# EAGLE design ICS40300-preamp-surfacemount_Rev-D (EAGLE 8.2.1)
COMPANY: ADAFRUIT INDUSTRIES; DRAWN: KTOWN; REV: A
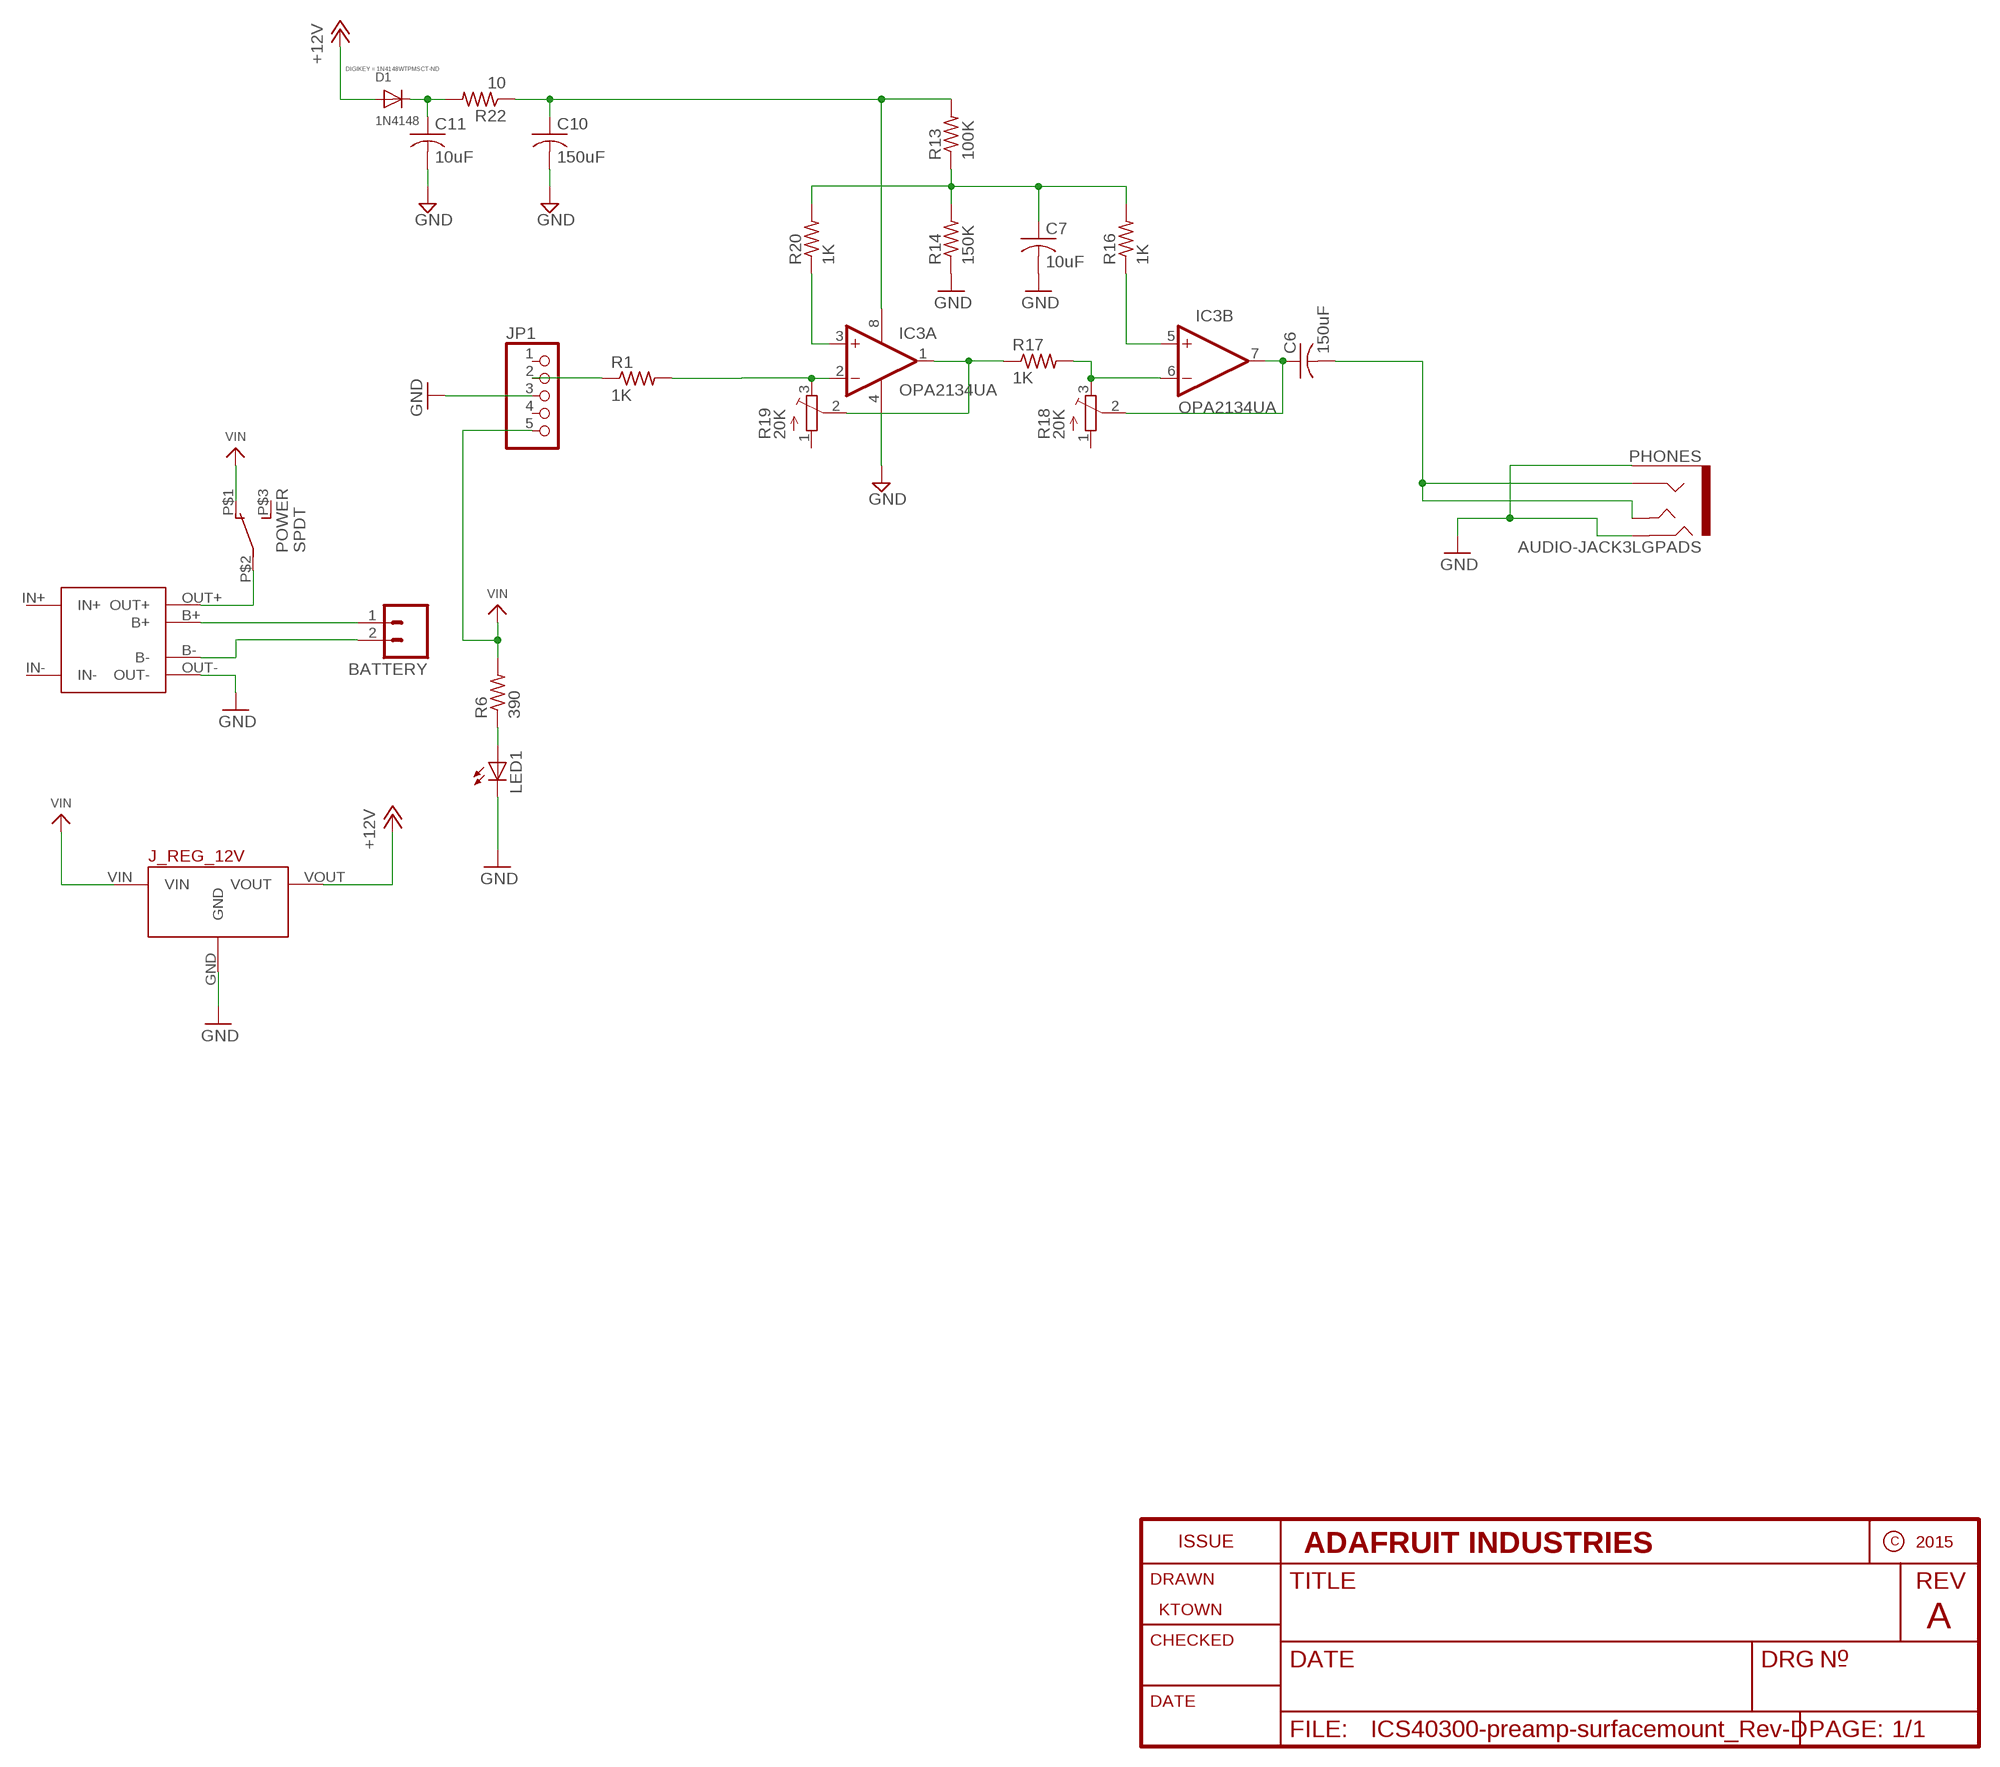
[diagram p0: schematic, sheet 1]

## Parts
BATTERY  M02LOCK  [1X02_LOCK]
C6  150uF  C-USC3216  [C3216]
C7  10uF  C-USC0805K  [C0805K]
C10  150uF  C-USC3216  [C3216]
C11  10uF  C-USC0805K  [C0805K]
D1  1N4148  DIODESOD-123  [SOD-123]
IC3  OPA2134UA  [SO08]
J_REG_12V  POLOLU_VOLTAGE_REGULATORS_3PIN  [POLOLU_5V-12V_STEPUP_U3V12F5-U3V12F12]
JP1  HEADER-1X576MIL  [1X05_ROUND_76]
LED1  LED3MM  [LED3MM]
PHONES  AUDIO-JACK3LGPADS  [AUDIO-JACK-TRRS-SMD]
POWER  SPDT  SWITCH_SPDTCL-SB-12B  [SWITCH_SPDT_CL-SB-12B]
R1  1K  R-US_R0805  [R0805]
R6  390  R-US_R0805  [R0805]
R13  100K  R-US_R0603  [R0603]
R14  150K  R-US_R0603  [R0603]
R16  1K  R-US_R0603  [R0603]
R17  1K  R-US_R0603  [R0603]
R18  20K  TRIMPOTTC33X  [TC33X]
R19  20K  TRIMPOTTC33X  [TC33X]
R20  1K  R-US_R0603  [R0603]
R22  10  R-US_R0603  [R0603]
U$1  TP4056-MODULETP4056  [TP4056-LITHIUM-PROTECTED-MODULE-MOVED-PAD]

## Nets
+12V: D1.A J_REG_12V.VOUT
GND: C7.2 C10.2 C11.2 IC3.4(A:V-) J_REG_12V.GND JP1.3 LED1.K(C) PHONES.EARTH PHONES.RING2 R14.1 U$1.OUT-
N$1: JP1.2 R1.1
N$3: POWER.P$2 U$1.OUT+
N$5: BATTERY.1 U$1.B+
N$6: BATTERY.2 U$1.B-
N$13: IC3.5(B:+IN) R16.1
N$14: C6.1 IC3.7(B:OUT) R18.2(S)
N$15: IC3.6(B:-IN) R17.2 R18.3(E)
N$16: LED1.A R6.1
N$17: C7.1 R13.1 R14.2 R16.2 R20.2
N$18: IC3.3(A:+IN) R20.1
N$19: IC3.1(A:OUT) R17.1 R19.2(S)
N$21: IC3.2(A:-IN) R1.2 R19.3(E)
N$25: C6.2 PHONES.RING1 PHONES.TIP
N$28: C11.1 D1.C R22.2
N$32: C10.1 IC3.8(A:V+) R13.2 R22.1
VIN: J_REG_12V.VIN JP1.5 POWER.P$1 R6.2
Unconnected: JP1.1 JP1.4 POWER.P$3 R18.1(A) R19.1(A)

## Power pins joined to a net without a drawn wire
IN+: U$1.IN+
IN-: U$1.IN-

## Library data of the parts
BATTERY = CMU-ArtFab:M02: Header 2 Standard 2-pin 0.1" header. Use with straight break away headers (SKU : PRT-00116), right angle break away headers (PRT-00553), swiss pins (PRT-00743), machine pins (PRT-00117), and female headers (PRT-00115). Molex polarized connector foot print use with SKU : PRT-08233 with associated crimp pins and housings.
C6 C7 C10 C11 = adafruit:C-US: CAPACITOR, American symbol
D1 = adafruit:DIODE: Diode SMADIODE - SMA Surface Mount Package 20V 1A Schottky Diode Digikey: 641-1014-6-ND DO-1N4148 - Through Hole Small Current Diode SOD-123 20V 1 A (.5mV Vf) Schottky Diode - Digikey: MBRX120TPMSCT-ND SOD-323 10V 570mA (.38mV Vf, 3ns) Schottky Diode - Digikey: ZLLS410CT-ND SOD-523 30V 30mA Schottky Diode (RB751S-40TE61) - Digikey: RB751S-40TE61CT-ND SOT23-R/W - SOT23 Package (R = Solder Paste/Reflow Ovens, W = Hand-Soldering) BAT54Film 40V 300mA - Digikey: 497-7162-1-ND; DIGIKEY: 1N4148WTPMSCT-ND
IC3 = linear:OPA2*: Dual Operational Amplifier Low Power, Single-Supply, Rail-To-Rail Operational Amplifier Source: http://focus.ti.com/lit/ds/symlink/opa2345.pdf http://focus.ti.com .. opa241.pdf http://focus.ti.com/lit/ds/symlink/opa2134.pdf
J_REG_12V = CMU-ArtFab:POLOLU_VOLTAGE_REGULATORS_3PIN: Polulu 5V Step-Up/Step-Down Voltage REgulator S7V7F5
JP1 = microbuilder:HEADER-1X5: PIN HEADER
LED1 = led:LED: LED OSRAM: - CHIPLED LG R971, LG N971, LY N971, LG Q971, LY Q971, LO R971, LY R971 LH N974, LH R974 LS Q976, LO Q976, LY Q976 LO Q996 - Hyper CHIPLED LW Q18S LB Q993, LB Q99A, LB R99A - SideLED LS A670, LO A670, LY A670, LG A670, LP A670 LB A673, LV A673, LT A673, LW A673 LH A674 LY A675 LS A676, LA A676, LO A676, LY A676, LW A676 LS A679, LY A679, LG A679 - Hyper Micro SIDELED® LS Y876, LA Y876, LO Y876, LY Y876 LT Y87S - SmartLED LW L88C, LW L88S LB L89C, LB L89S, LG L890 LS L89K, LO L89K, LY L89K LS L896, LA L896, LO L896, LY L896 - TOPLED LS T670, LO T670, LY T670, LG T670, LP T670 LSG T670, LSP T670, LSY T670, LOP T670, LYG T670 LG T671, LOG T671, LSG T671 LB T673, LV T673, LT T673, LW T673 LH T674 LS T676, LA T676, LO T676, LY T676, LB T676, LH T676, LSB T676, LW T676 LB T67C, LV T67C, LT T67C, LS T67K, LO T67K, LY T67K, LW E67C LS E67B, LA E67B, LO E67B, LY E67B, LB E67C, LV E67C, LT E67C LW T67C LS T679, LY T679, LG T679 LS T770, LO T770, LY T770, LG T770, LP T770 LB T773, LV T773, LT T773, LW T773 LH T774 LS E675, LA E675, LY E675, LS T675 LS T776, LA T776, LO T776, LY T776, LB T776 LHGB T686 LT T68C, LB T68C - Hyper Mini TOPLED® LB M676 - Mini TOPLED Santana® LG M470 LS M47K, LO M47K, LY M47K Source: http://www.osram.convergy.de LUXEON: - LUMILED® LXK2-PW12-R00, LXK2-PW12-S00, LXK2-PW14-U00, LXK2-PW14-V00 LXK2-PM12-R00, LXK2-PM12-S00, LXK2-PM14-U00 LXK2-PE12-Q00, LXK2-PE12-R00, LXK2-PE12-S00, LXK2-PE14-T00, LXK2-PE14-U00 LXK2-PB12-K00, LXK2-PB12-L00, LXK2-PB12-M00, LXK2-PB14-N00, LXK2-PB14-P00, LXK2-PB14-Q00 LXK2-PR12-L00, LXK2-PR12-M00, LXK2-PR14-Q00, LXK2-PR14-R00 LXK2-PD12-Q00, LXK2-PD12-R00, LXK2-PD12-S00 LXK2-PH12-R00, LXK2-PH12-S00 LXK2-PL12-P00, LXK2-PL12-Q00, LXK2-PL12-R00 Source: www.luxeon.com KINGBRIGHT: KA-3528ASYC Source: www.kingbright.com
PHONES = Daniel:AUDIO-JACK3: Audio jack - 3.5mm TRRS variety - two rings.
POWER = CMU-ArtFab:SWITCH_SPDT
R1 R6 R13 R14 R16 R17 R20 R22 = CMU-ArtFab:R-US_: RESISTOR, American symbol
R18 R19 = adafruit:TRIMPOT: SMT trimmer potentiometer part number TC33X http://www.ladyada.net/library/eagle
U$1 = CMU-ArtFab:TP4056-MODULE

## Board
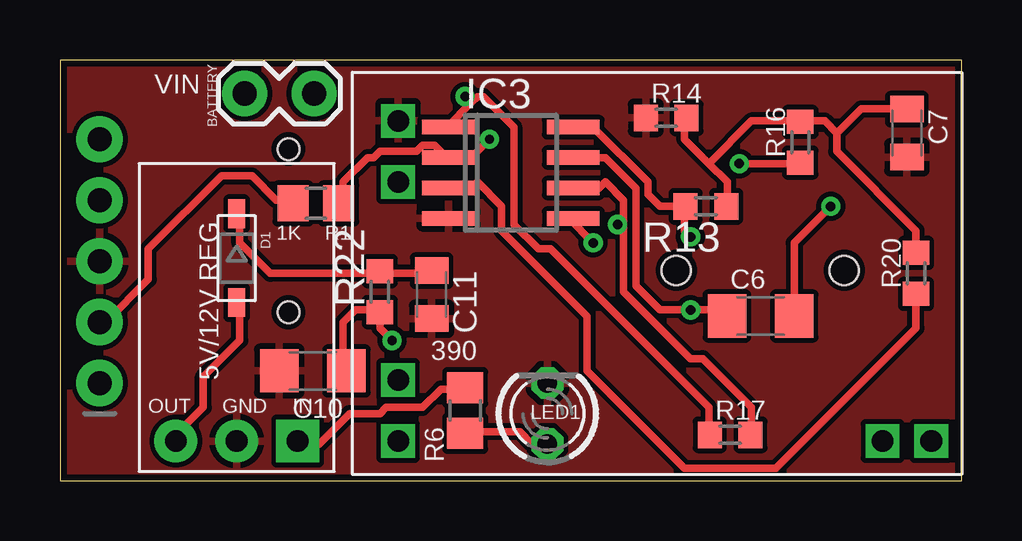
[diagram p1: board, top side]
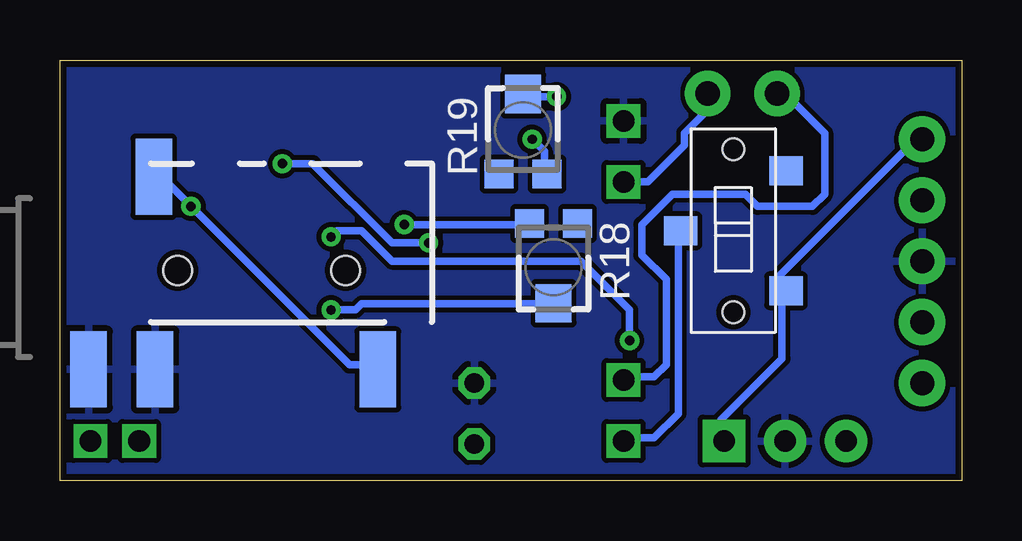
[diagram p2: board, bottom side, seen from below]

Size 37.59 x 17.53 mm. Coordinates in mm from the lower left corner, seen from the top.
Outline: 0,0 37.59,0 37.59,17.53 0,17.53 0,0
Copper layers (1*16): Top 0.035mm / dielectric 1.5mm / Bottom 0.035mm
Design rules "adafruit *": minimum track width 12mil, minimum drill 15.5mil, track to track 8mil, track to pad 8mil, pad to pad 8mil, via to via 8mil, smd to smd 8mil, copper to edge 10mil, drill to drill 8mil, minimum pad ring 10mil, minimum via ring 8mil, stop-mask expansion 2mil, vias tented up to drill 20mil, thermal gap 10mil

### Footprints (pad centres in the part's own frame; a part is rotated, then mirrored left to right if it is on the bottom)
1X02_LOCK = drill 1.016 pad 1.88: 1 -0.178,0; 2 2.718,0
C3216 = smd 1.6 x 1.8: 1 -1.4,0; 2 1.4,0
C0805K = smd 1.1 x 1.4: 1 -1,0; 2 1,0
SOD-123 = smd 1.2 x 0.7: A 1.85,0; C -1.85,0
SO08 = smd 0.6 x 2.2: 1 -1.905,-2.6; 2 -0.635,-2.6; 3 0.635,-2.6; 4 1.905,-2.6; 5 1.905,2.6; 6 0.635,2.6; 7 -0.635,2.6; 8 -1.905,2.6
POLOLU_5V-12V_STEPUP_U3V12F5-U3V12F12 = drill 0.9 pad 1.778: GND 0,-6.35; VOUT -2.54,-6.35 | drill 0.9 pad 1.778 square: VIN 2.54,-6.35
1X05_ROUND_76 = drill 1 pad 1.93: 1 -5.08,0; 2 -2.54,0; 3 0,0; 4 2.54,0; 5 5.08,0
LED3MM = drill 0.813 octagon: A -1.27,0; K 1.27,0
AUDIO-JACK-TRRS-SMD = smd 1.524 x 3.175: EARTH -2.114,-5.271; RING1 0.612,2.759; RING2 0.66,-5.271; TIP 9.948,-5.271 | hole 1.2: 1.6,-1.15; 8.6,-1.15
SWITCH_SPDT_CL-SB-12B = smd 1.2 x 1.4: P$1 -2.5,-2.2; P$2 0,2.2; P$3 2.5,-2.2 | hole 0.9: -3.4,0; 3.4,0
R0805 = smd 1.3 x 1.5: 1 -0.95,0; 2 0.95,0
R0603 = smd 1 x 1.1: 1 -0.85,0; 2 0.85,0
TC33X = smd 1.2 x 1.2: 1 -1,-1.825; 3 1,-1.825 | smd 1.5 x 1.6: 2 0,1.5
TP4056-LITHIUM-PROTECTED-MODULE-MOVED-PAD = drill 0.9 square: B+ 10.795,4.445; B- 10.795,-3.81; IN+ -11.43,6.985; IN- -9.398,6.985; OUT+ 10.795,6.985; OUT- 10.795,-6.35

### Placement (x,y rotation side)
BATTERY  7.87,16.13 0 top
C6  29.21,6.86 0 top
C7  35.31,14.48 270 top
C10  10.54,4.57 180 top
C11  15.49,7.75 270 top
D1  7.37,9.27 270 top
IC3  18.8,12.83 270 top
J_REG_12V  7.37,8 0 top
JP1  1.65,9.14 90 top
LED1  20.32,2.79 90 top
PHONES  34.29,9.91 0 bottom
POWER  9.52,10.41 90 bottom
R1  10.67,11.56 0 top
R6  16.89,2.92 90 top
R13  26.92,11.43 180 top
R14  25.27,15.11 0 top
R16  30.86,14.1 90 top
R17  27.94,1.91 0 top
R18  17.02,8.89 180 bottom
R19  18.29,14.61 0 bottom
R20  35.69,8.64 90 top
R22  13.34,7.87 90 top
U$1  24.89,8.64 180 top

### Tracks (layer width: path | path; a pad name or v marks a point on that pad's centre or on a via)
+12V
  Top 0.305: D1.A 7.49,7.37 7.49,5.84 5.97,4.32 5.97,3.05 4.7,1.78 J_REG_12V.VOUT
GND
  pour Top: 37.97,-0.76 37.97,19.05 -0.25,19.05 -0.25,-0.76
  pour Bottom: -0.25,-0.76 37.97,-0.76 37.97,19.81 -0.25,19.81
N$1
  Top 0.305: JP1.2 1.9,6.6 3.68,8.38 3.68,9.65 6.73,12.7 8,12.7 9.02,11.68 9.52,11.68 R1.1
N$3
  Bottom 0.305: POWER.P$2 11.81,10.41 11.81,2.79 12.83,1.78 14.1,1.78 U$1.OUT+
N$5
  Bottom 0.305: U$1.B+ 14.1,4.32 12.83,4.32 12.32,4.83 12.32,8.38 13.34,9.4 13.34,10.67 12.07,11.94 9.02,11.94 8.51,11.43 6.22,11.43 5.71,11.94 5.71,14.48 7.49,16.26 BATTERY.1
N$6
  Bottom 0.305: U$1.B- 13.08,12.45 11.56,13.97 11.56,14.48 10.79,15.24 10.79,16 BATTERY.2
N$13  (via drill 0.39)
  Top 0.305: v28.32,13.21 30.86,13.21 R16.1 | v22.23,9.91 21.21,10.92 IC3.5
  Bottom 0.305: v28.32,13.21 27.05,13.21 23.75,9.91 v22.23,9.91
N$14  (via drill 0.39)
  Top 0.305: C6.1 27.56,6.86 27.3,7.11 v26.29,7.11 25.02,7.11 24,8.13 24,12.19 22.73,13.46 IC3.7
  Bottom 0.305: v26.29,7.11 25.27,7.11 25.02,7.37 17.14,7.37 R18.2
N$15  (via drill 0.39)
  Top 0.305: 23.5,10.67 23.5,11.68 22.73,12.45 22.48,12.19 IC3.6 | 23.5,10.67 23.5,7.87 26.29,5.08 26.8,5.08 28.83,3.05 28.83,2.03 R17.2 | 23.5,10.67 v23.24,10.67
  Bottom 0.305: v23.24,10.67 18.16,10.67 R18.3
N$16
  Top 0.305: LED1.A 19.69,1.52 19.18,2.03 16.89,2.03 R6.1
N$17
  Top 0.305: 27.05,13.21 26.04,14.22 26.04,14.99 R14.2 | 27.05,13.21 27.81,12.45 27.81,11.43 R13.1 | R20.2 35.69,10.41 32.38,13.72 32.38,14.48 | 32.38,14.48 31.88,14.99 30.86,14.99 | 32.38,14.48 33.4,15.49 35.18,15.49 C7.1 | 27.05,13.21 28.83,14.99 30.86,14.99 | 30.86,14.99 R16.2
N$18
  Top 0.305: R20.1 35.69,6.35 29.85,0.51 26.04,0.51 21.97,4.57 21.97,6.86 18.41,10.41 18.41,11.43 17.4,12.45 17.14,12.19 IC3.3
N$19  (via drill 0.39)
  Top 0.305: 17.14,15.75 16.13,14.73 IC3.1 | 17.14,15.75 17.4,16 17.65,16 18.92,14.73 18.92,10.67 19.94,9.65 20.45,9.65 27.05,3.05 27.05,2.03 R17.1 | 17.14,15.75 v16.89,16
  Bottom 0.305: v16.89,16 18.16,16 R19.2
N$21  (via drill 0.39)
  Top 0.305: v17.91,14.22 17.14,13.46 IC3.2 16.13,13.46 15.62,13.97 15.11,13.97 14.86,13.72 13.34,13.72 13.08,13.46 12.83,13.46 11.81,12.45 11.81,11.68 R1.2
  Bottom 0.305: v17.91,14.22 17.4,13.72 17.4,12.95 R19.3
N$25  (via drill 0.39)
  Top 0.305: v32.13,11.43 30.61,9.91 C6.2
  Bottom 0.305: PHONES.RING1 33.66,12.45 33.15,12.45 v32.13,11.43 25.53,4.83 24.51,4.83 PHONES.TIP
N$28
  Top 0.305: 13.34,8.64 15.37,8.64 C11.1 | 13.34,8.64 8.76,8.64 7.49,9.91 7.49,10.92 D1.C | 13.34,8.64 R22.2
N$32  (via drill 0.39)
  Top 0.305: C10.1 11.81,4.57 11.81,6.6 12.32,7.11 13.34,7.11 R22.1 13.34,6.35 v13.84,5.84 | 26.04,11.43 25.02,11.43 24.51,11.94 24.51,12.45 22.23,14.73 IC3.8 | v26.29,10.16 26.04,10.41 26.04,11.43 | 26.04,11.43 R13.2
  Bottom 0.305: v13.84,5.84 13.84,7.11 15.88,9.14 23.75,9.14 25.02,10.41 26.04,10.41 v26.29,10.16
VIN
  Top 0.305: R6.2 16.89,3.81 15.88,3.81 15.11,3.05 13.59,3.05 13.34,2.79 12.07,2.79 10.79,1.52 10.03,1.52 J_REG_12V.VIN
  Bottom 0.305: 7.49,7.87 7.49,5.08 10.03,2.54 10.03,1.78 J_REG_12V.VIN | JP1.5 2.16,13.72 2.41,13.72 7.75,8.38 7.75,8.13 7.49,7.87 | 7.49,7.87 POWER.P$1

### Text on the board
tNames: VIN